# EAGLE board PiPanel (EAGLE 6.6.0)
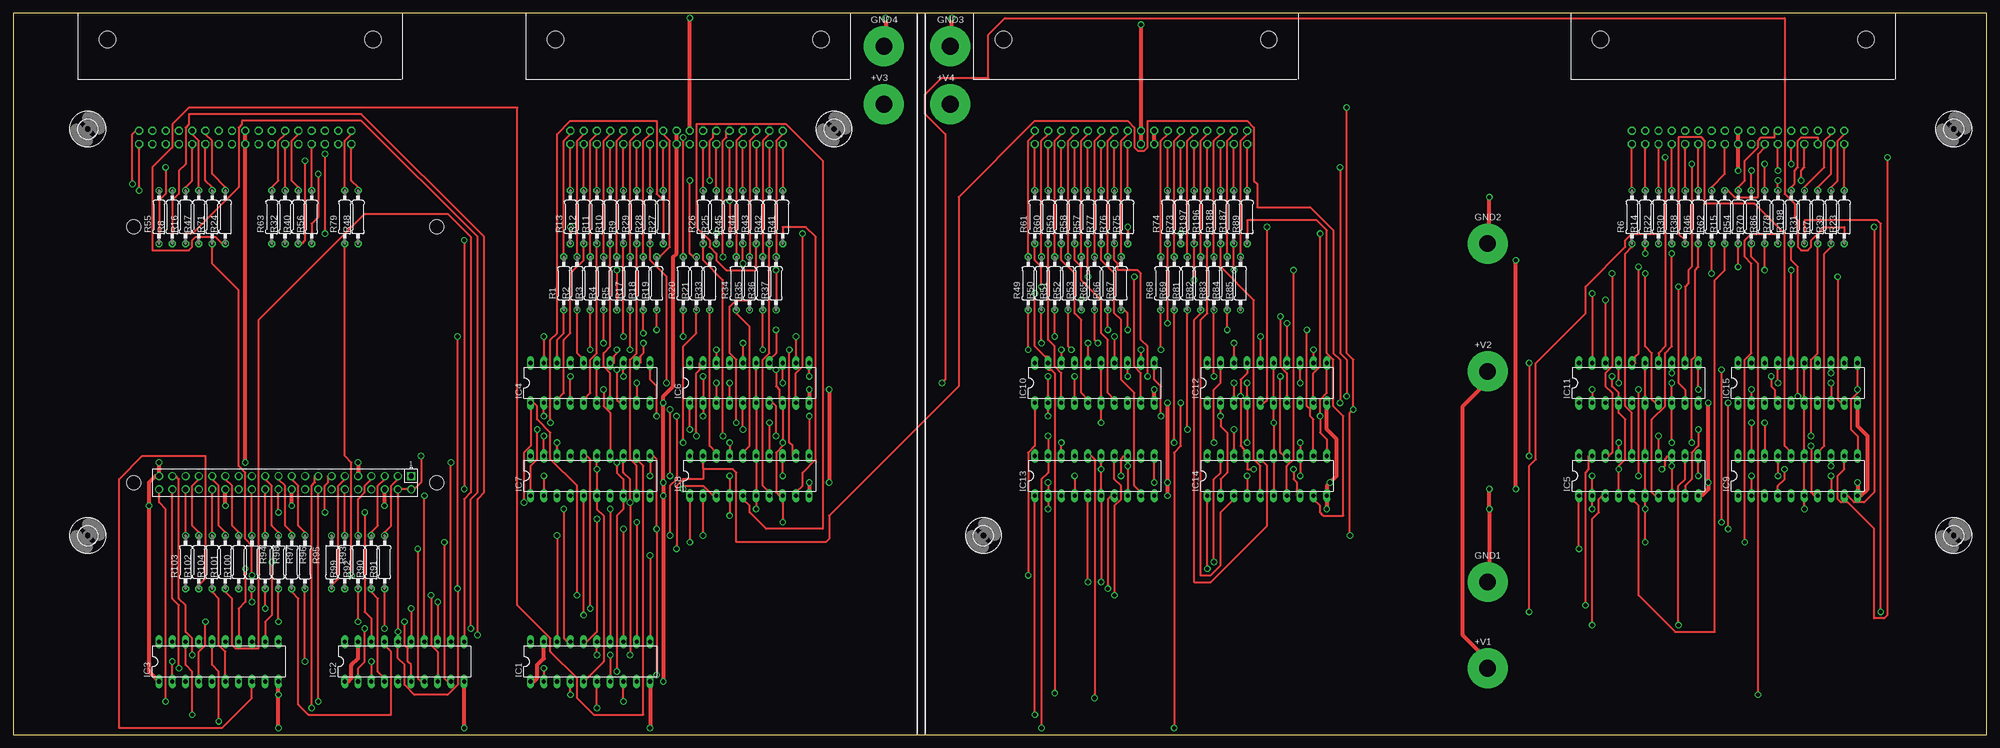
[diagram p2: board, top side]
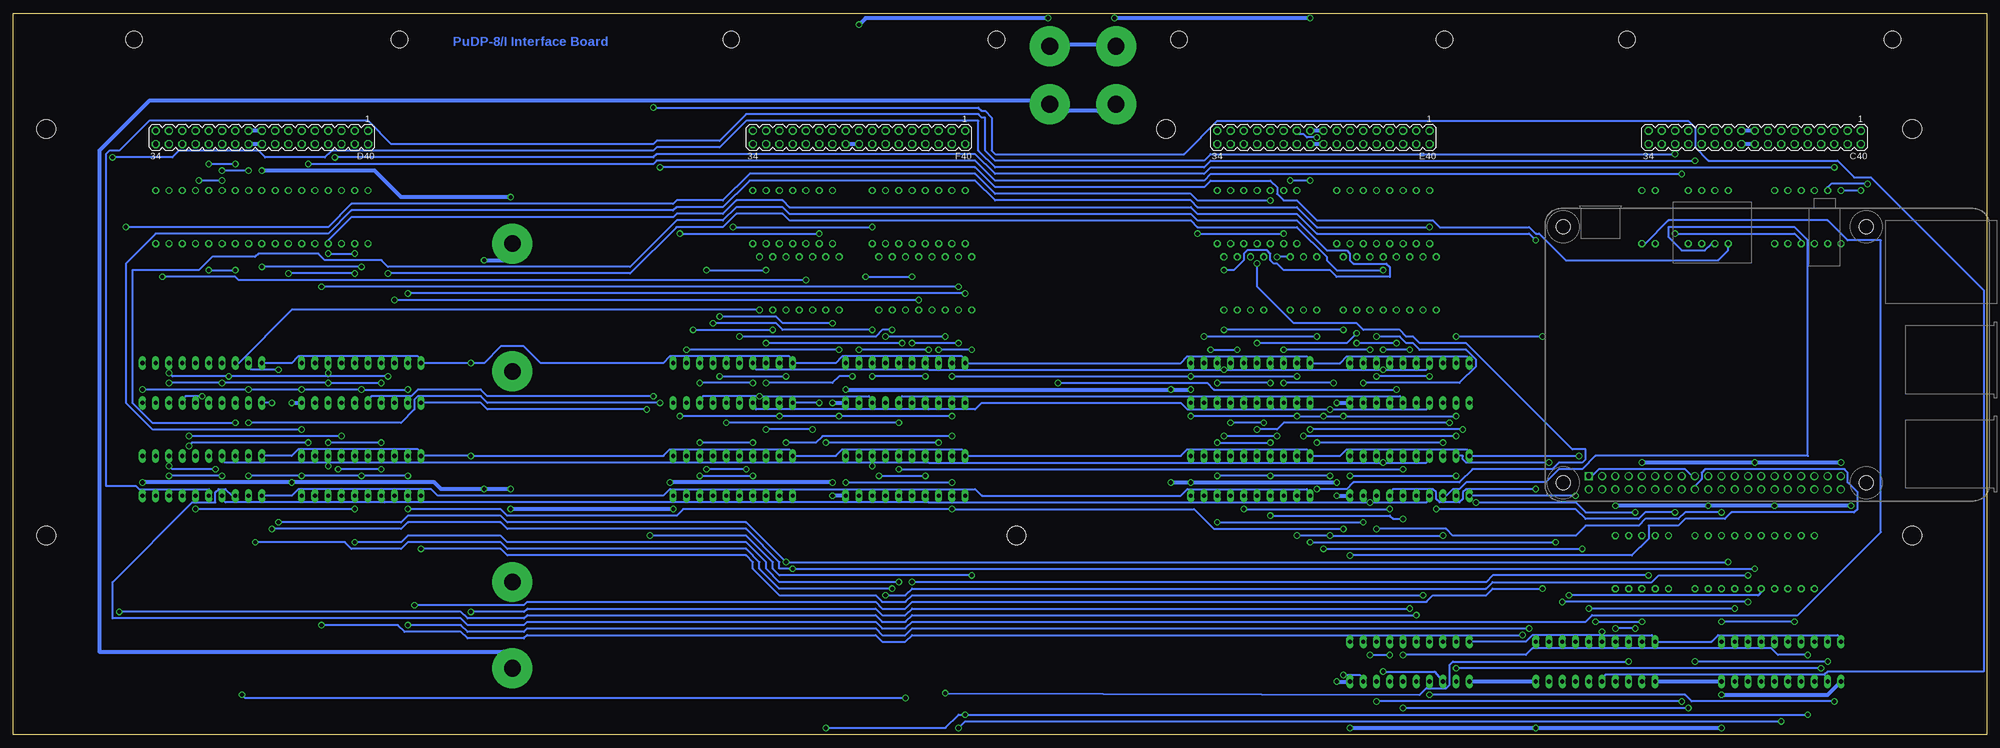
[diagram p3: board, bottom side, seen from below]

Size 377.82 x 138.11 mm. Coordinates in mm from the lower left corner, seen from the top.
Outline: 377.82,0 377.82,138.11 0,138.11 0,0 377.82,0
Outline: 174.62,0 377.82,0
Copper layers (1+16): Top 0.035mm / dielectric 1.5mm / Bottom 0.035mm
Design rules "16mils": minimum track width 16mil, minimum drill 32mil, track to track 15mil, track to pad 10mil, pad to pad 10mil, via to via 10mil, smd to smd 10mil, copper to edge 13mil, drill to drill 10mil, minimum pad ring 10mil, minimum via ring 8mil, stop-mask expansion 0mil, vias tented up to drill 0mil, thermal gap 10mil
Net classes: 1 supply: width 0.762 mm

## Footprints (pad centres in the part's own frame; a part is rotated, then mirrored left to right if it is on the bottom)
SPADELUG = drill 3.175 pad 7.62: 1 0,0
MA17-2 = drill 1.016 octagon: 1 -20.32,-1.27; 2 -20.32,1.27; 3 -17.78,-1.27; 4 -17.78,1.27; 5 -15.24,-1.27; 6 -15.24,1.27; 7 -12.7,-1.27; 8 -12.7,1.27; 9 -10.16,-1.27; 10 -10.16,1.27; 11 -7.62,-1.27; 12 -7.62,1.27; 13 -5.08,-1.27; 14 -5.08,1.27; 15 -2.54,-1.27; 16 -2.54,1.27; 17 0,-1.27; 18 0,1.27; 19 2.54,-1.27; 20 2.54,1.27; 21 5.08,-1.27; 22 5.08,1.27; 23 7.62,-1.27; 24 7.62,1.27; 25 10.16,-1.27; 26 10.16,1.27; 27 12.7,-1.27; 28 12.7,1.27; 29 15.24,-1.27; 30 15.24,1.27; 31 17.78,-1.27; 32 17.78,1.27; 33 20.32,-1.27; 34 20.32,1.27
DIL20 = drill 0.813 long: 1 -11.43,-3.81; 2 -8.89,-3.81; 3 -6.35,-3.81; 4 -3.81,-3.81; 5 -1.27,-3.81; 6 1.27,-3.81; 7 3.81,-3.81; 8 6.35,-3.81; 9 8.89,-3.81; 10 11.43,-3.81; 11 11.43,3.81; 12 8.89,3.81; 13 6.35,3.81; 14 3.81,3.81; 15 1.27,3.81; 16 -1.27,3.81; 17 -3.81,3.81; 18 -6.35,3.81; 19 -8.89,3.81; 20 -11.43,3.81
0207/10 = drill 0.813 octagon: 1 -5.08,0; 2 5.08,0
STRAIN-RELIEF = hole 3.175: 7.62,56.515; 7.62,5.715
3,6 = hole 3.6: 0,0
RASPI_BOARD_B+_FULL = drill 1.016 square: 1 8.878,52.119 | drill 1.016: 2 8.878,54.659; 3 11.418,52.119; 4 11.418,54.659; 5 13.958,52.119; 6 13.958,54.659; 7 16.498,52.119; 8 16.498,54.659; 9 19.038,52.119; 10 19.038,54.659; 11 21.578,52.119; 12 21.578,54.659; 13 24.118,52.119; 14 24.118,54.659; 15 26.658,52.119; 16 26.658,54.659; 17 29.198,52.119; 18 29.198,54.659; 19 31.738,52.119; 20 31.738,54.659; 21 34.278,52.119; 22 34.278,54.659; 23 36.818,52.119; 24 36.818,54.659; 25 39.358,52.119; 26 39.358,54.659; 27 41.898,52.119; 28 41.898,54.659; 29 44.438,52.119; 30 44.438,54.659; 31 46.978,52.119; 32 46.978,54.659; 33 49.518,52.119; 34 49.518,54.659; 35 52.058,52.119; 36 52.058,54.659; 37 54.598,52.119; 38 54.598,54.659; 39 57.138,52.119; 40 57.138,54.659 | hole 2.75: 4.008,4.389; 4.008,53.389; 62.008,4.389; 62.008,53.389

## Placement (x,y rotation side)
+V1  LUG  [SPADELUG]  282.26,12.7 0 top
+V2  LUG  [SPADELUG]  282.26,69.53 0 top
+V3  LUG  [SPADELUG]  166.69,120.65 0 top
+V4  LUG  [SPADELUG]  179.39,120.65 0 top
C40  [MA17-2]  44.45,114.3 180 bottom
D40  [MA17-2]  330.2,114.3 180 bottom
E40  [MA17-2]  127,114.3 180 bottom
F40  [MA17-2]  215.9,114.3 180 bottom
GND1  LUG  [SPADELUG]  282.26,29.21 0 top
GND2  LUG  [SPADELUG]  282.26,93.98 0 top
GND3  LUG  [SPADELUG]  179.39,131.76 0 top
GND4  LUG  [SPADELUG]  166.69,131.76 0 top
IC1  74LS244N  [DIL20]  110.49,13.97 0 top
IC2  74LS244N  [DIL20]  74.93,13.97 0 top
IC3  74LS244N  [DIL20]  39.37,13.97 0 top
IC4  74LS244N  [DIL20]  110.49,67.31 0 top
IC5  74LS244N  [DIL20]  311.15,49.53 0 top
IC6  74LS244N  [DIL20]  140.97,67.31 0 top
IC7  74LS244N  [DIL20]  110.49,49.53 0 top
IC8  74LS244N  [DIL20]  140.97,49.53 0 top
IC9  74LS244N  [DIL20]  341.63,49.53 0 top
IC10  74LS244N  [DIL20]  207.01,67.31 0 top
IC11  74LS244N  [DIL20]  311.15,67.31 0 top
IC12  74LS244N  [DIL20]  240.03,67.31 0 top
IC13  74LS244N  [DIL20]  207.01,49.53 0 top
IC14  74LS244N  [DIL20]  240.03,49.53 0 top
IC15  74LS244N  [DIL20]  341.63,67.31 0 top
R1  4.7K  [0207/10]  105.41,86.36 90 top
R2  4.7K  [0207/10]  107.95,86.36 90 top
R3  4.7K  [0207/10]  110.49,86.36 90 top
R4  4.7K  [0207/10]  113.03,86.36 90 top
R5  4.7K  [0207/10]  115.57,86.36 90 top
R6  4.7K  [0207/10]  309.88,99.06 90 top
R7  4.7K  [0207/10]  345.44,99.06 90 top
R8  4.7K  [0207/10]  30.48,99.06 90 top
R9  4.7K  [0207/10]  116.84,99.06 90 top
R10  4.7K  [0207/10]  114.3,99.06 90 top
R11  4.7K  [0207/10]  111.76,99.06 90 top
R12  4.7K  [0207/10]  109.22,99.06 90 top
R13  4.7K  [0207/10]  106.68,99.06 90 top
R14  4.7K  [0207/10]  312.42,99.06 90 top
R15  4.7K  [0207/10]  327.66,99.06 90 top
R16  4.7K  [0207/10]  33.02,99.06 90 top
R17  4.7K  [0207/10]  118.11,86.36 90 top
R18  4.7K  [0207/10]  120.65,86.36 90 top
R19  4.7K  [0207/10]  123.19,86.36 90 top
R20  4.7K  [0207/10]  128.27,86.36 90 top
R21  4.7K  [0207/10]  130.81,86.36 90 top
R22  4.7K  [0207/10]  314.96,99.06 90 top
R23  4.7K  [0207/10]  350.52,99.06 90 top
R24  4.7K  [0207/10]  40.64,99.06 90 top
R25  4.7K  [0207/10]  134.62,99.06 90 top
R26  4.7K  [0207/10]  132.08,99.06 90 top
R27  4.7K  [0207/10]  124.46,99.06 90 top
R28  4.7K  [0207/10]  121.92,99.06 90 top
R29  4.7K  [0207/10]  119.38,99.06 90 top
R30  4.7K  [0207/10]  317.5,99.06 90 top
R31  4.7K  [0207/10]  342.9,99.06 90 top
R32  4.7K  [0207/10]  52.07,99.06 90 top
R33  4.7K  [0207/10]  133.35,86.36 90 top
R34  4.7K  [0207/10]  138.43,86.36 90 top
R35  4.7K  [0207/10]  140.97,86.36 90 top
R36  4.7K  [0207/10]  143.51,86.36 90 top
R37  4.7K  [0207/10]  146.05,86.36 90 top
R38  4.7K  [0207/10]  320.04,99.06 90 top
R39  4.7K  [0207/10]  347.98,99.06 90 top
R40  4.7K  [0207/10]  54.61,99.06 90 top
R41  4.7K  [0207/10]  147.32,99.06 90 top
R42  4.7K  [0207/10]  144.78,99.06 90 top
R43  4.7K  [0207/10]  142.24,99.06 90 top
R44  4.7K  [0207/10]  139.7,99.06 90 top
R45  4.7K  [0207/10]  137.16,99.06 90 top
R46  4.7K  [0207/10]  322.58,99.06 90 top
R47  4.7K  [0207/10]  35.56,99.06 90 top
R48  4.7K  [0207/10]  66.04,99.06 90 top
R49  4.7K  [0207/10]  194.31,86.36 90 top
R50  4.7K  [0207/10]  196.85,86.36 90 top
R51  4.7K  [0207/10]  199.39,86.36 90 top
R52  4.7K  [0207/10]  201.93,86.36 90 top
R53  4.7K  [0207/10]  204.47,86.36 90 top
R54  4.7K  [0207/10]  330.2,99.06 90 top
R55  4.7K  [0207/10]  27.94,99.06 90 top
R56  4.7K  [0207/10]  57.15,99.06 90 top
R57  4.7K  [0207/10]  205.74,99.06 90 top
R58  4.7K  [0207/10]  203.2,99.06 90 top
R59  4.7K  [0207/10]  200.66,99.06 90 top
R60  4.7K  [0207/10]  198.12,99.06 90 top
R61  4.7K  [0207/10]  195.58,99.06 90 top
R62  4.7K  [0207/10]  325.12,99.06 90 top
R63  4.7K  [0207/10]  49.53,99.06 90 top
R65  4.7K  [0207/10]  207.01,86.36 90 top
R66  4.7K  [0207/10]  209.55,86.36 90 top
R67  4.7K  [0207/10]  212.09,86.36 90 top
R68  4.7K  [0207/10]  219.71,86.36 90 top
R69  4.7K  [0207/10]  222.25,86.36 90 top
R70  4.7K  [0207/10]  332.74,99.06 90 top
R71  4.7K  [0207/10]  38.1,99.06 90 top
R73  4.7K  [0207/10]  223.52,99.06 90 top
R74  4.7K  [0207/10]  220.98,99.06 90 top
R75  4.7K  [0207/10]  213.36,99.06 90 top
R76  4.7K  [0207/10]  210.82,99.06 90 top
R77  4.7K  [0207/10]  208.28,99.06 90 top
R78  4.7K  [0207/10]  337.82,99.06 90 top
R79  4.7K  [0207/10]  63.5,99.06 90 top
R81  4.7K  [0207/10]  224.79,86.36 90 top
R82  4.7K  [0207/10]  227.33,86.36 90 top
R83  4.7K  [0207/10]  229.87,86.36 90 top
R84  4.7K  [0207/10]  232.41,86.36 90 top
R85  4.7K  [0207/10]  234.95,86.36 90 top
R86  4.7K  [0207/10]  335.28,99.06 90 top
R89  4.7K  [0207/10]  236.22,99.06 90 top
R90  [0207/10]  68.58,33.02 90 top
R91  [0207/10]  71.12,33.02 90 top
R92  [0207/10]  66.04,33.02 90 top
R93  4K  [0207/10]  60.96,33.02 270 top
R94  [0207/10]  45.72,33.02 270 top
R95  [0207/10]  55.88,33.02 270 top
R96  [0207/10]  53.34,33.02 270 top
R97  [0207/10]  50.8,33.02 270 top
R98  [0207/10]  48.26,33.02 270 top
R99  4K  [0207/10]  63.5,33.02 90 top
R100  [0207/10]  43.18,33.02 90 top
R101  [0207/10]  40.64,33.02 90 top
R102  [0207/10]  35.56,33.02 90 top
R103  4K  [0207/10]  33.02,33.02 90 top
R104  [0207/10]  38.1,33.02 90 top
R187  4.7K  [0207/10]  233.68,99.06 90 top
R188  4.7K  [0207/10]  231.14,99.06 90 top
R196  4.7K  [0207/10]  228.6,99.06 90 top
R197  4.7K  [0207/10]  226.06,99.06 90 top
R198  4.7K  [0207/10]  340.36,99.06 90 top
U$1  [STRAIN-RELIEF]  74.61,125.41 90 top
U$2  [STRAIN-RELIEF]  160.34,125.41 90 top
U$3  [STRAIN-RELIEF]  246.06,125.41 90 top
U$4  [STRAIN-RELIEF]  360.36,125.41 90 top
U$5  [3,6]  371.48,115.89 0 top
U$6  [3,6]  371.48,38.1 0 top
U$7  [3,6]  185.74,38.1 0 top
U$8  [3,6]  14.29,38.1 0 top
U$9  [3,6]  14.29,115.89 0 top
U$11  [3,6]  157.16,115.89 0 top
X1  RASPI_BOARD_B+_F  [RASPI_BOARD_B+_FULL]  85.09,101.6 180 top

## Tracks (layer width: path | path; a pad name or v marks a point on that pad's centre or on a via)
+3V3
  Bottom 0.406: X1.17 56.52,49.53 57.78,50.8 74.3,50.8 75.56,49.53 X1.1
+15V
  Top 0.762: +V1.1 280.67,15.88 277.5,19.05 277.5,62.87 280.67,66.04 +V2.1
  Bottom 0.762: +V3.1 170.18,119.38 175.9,119.38 +V4.1 182.88,121.28 351.79,121.28 361.31,111.76 361.31,15.88 283.85,15.88 +V1.1
AC0
  Top 0.406: R4.2 113.03,113.67 114.3,114.94 E40.7
AC1
  Top 0.406: R12.2 E40.4
AC2  (via drill 0.81)
  Top 0.406: R20.2 v128.27,114.3
  Bottom 0.406: v128.27,114.3 130.18,114.3 130.81,114.94 132.08,114.94 E40.21
AC3
  Top 0.406: R28.2 E40.14
AC4
  Top 0.406: R36.2 143.51,113.67 144.78,114.94 E40.31
AC5
  Top 0.406: R44.2 E40.28
AC6
  Top 0.406: R52.2 201.93,113.67 203.2,114.94 F40.7
AC7
  Top 0.406: R60.2 F40.4
AC8
  Top 0.406: R68.2 219.71,113.67 220.98,114.94 F40.21
AC9
  Top 0.406: R76.2 F40.14
AC10
  Top 0.406: R84.2 232.41,113.67 233.68,114.94 F40.31
AC11
  Top 0.406: R196.2 F40.28
AND
  Top 0.406: R6.2 D40.2
BREAK
  Top 0.406: R15.2 328.3,104.14 329.56,102.87 334.01,102.87 334.01,111.12 335.28,112.39 D40.22
CA
  Top 0.406: R7.2 345.44,104.78 347.98,107.31 D40.32
COL1  (via drill 0.81)
  Top 0.406: v67.31,42.55 67.31,23.5 68.58,22.23 IC2.18 | v97.79,44.45 97.79,53.98 99.06,55.24 IC4.1 99.69,63.5 100.33,62.87 100.33,60.33 102.87,57.78 102.87,52.7 107.95,47.62 v107.95,26.67 | v299.72,35.56 IC5.1
  Bottom 0.406: v67.31,42.55 76.83,42.55 78.74,44.45 v97.79,44.45 | v299.72,35.56 284.48,35.56 283.21,34.29 237.49,34.29 236.22,33.02 236.22,31.75 231.14,26.67 212.72,26.67 211.46,25.4 207.01,25.4 205.74,26.67 v107.95,26.67
COL2  (via drill 0.81)
  Top 0.406: v85.09,76.2 v85.09,27.94 85.09,9.53 83.19,7.62 76.83,7.62 74.93,9.53 74.93,13.34 73.66,14.61 IC2.16 | v101.6,76.2 IC4.19 | v300.99,24.77 300.99,50.16 301.62,50.8 301.62,53.34 IC5.19
  Bottom 0.406: v85.09,76.2 v101.6,76.2 | v300.99,24.77 280.04,24.77 279.4,25.4 212.72,25.4 211.46,24.13 207.01,24.13 205.74,25.4 107.31,25.4 106.05,26.67 95.89,26.67 94.61,27.94 v85.09,27.94
COL3  (via drill 0.81)
  Top 0.406: IC2.14 v78.74,45.72 | v100.33,58.42 100.33,52.7 99.06,51.44 IC7.1 | v129.54,58.42 IC6.1
  Bottom 0.406: v78.74,45.72 IC7.1 | v100.33,58.42 v129.54,58.42
COL4  (via drill 0.81)
  Top 0.406: IC2.12 v83.82,52.07 | v130.81,57.15 130.81,69.22 131.44,69.85 131.44,71.12 IC6.19 | IC7.19 v101.6,57.15
  Bottom 0.406: v83.82,52.07 99.69,52.07 100.33,52.7 100.33,53.34 IC7.19 | v101.6,57.15 v130.81,57.15
COL5  (via drill 0.81)
  Top 0.406: v82.55,36.83 82.55,10.79 83.19,10.16 IC2.9 | IC8.1 v129.54,36.83
  Bottom 0.406: IC9.1 324.49,45.72 323.21,46.99 297.81,46.99 296.55,45.72 253.37,45.72 252.09,46.99 193.68,46.99 192.41,45.72 154.31,45.72 153.03,46.99 130.18,46.99 129.54,46.35 IC8.1 | v129.54,36.83 v82.55,36.83
COL6  (via drill 0.81)
  Top 0.406: v77.47,35.56 77.47,10.79 78.11,10.16 IC2.7 | v127,35.56 127,47.62 128.27,48.9 132.08,48.9 132.08,50.8 | 132.08,50.8 IC8.19 | v254,63.5 254,71.75 252.73,73.03 252.73,96.52 248.28,100.97 238.12,100.97 238.12,105.41 237.49,106.05 237.49,116.2 236.22,117.47 217.17,117.47 217.17,112.39 216.53,111.76 215.26,111.76 214.63,112.39 214.63,116.2 213.36,117.47 195.58,117.47 180.97,102.87 180.97,66.67 156.21,41.91 156.21,37.47 155.57,36.83 138.43,36.83 138.43,50.16 137.79,50.8 132.08,50.8 | v332.74,59.69 IC9.19
  Bottom 0.406: v127,35.56 v77.47,35.56 | v332.74,59.69 303.53,59.69 300.99,62.23 300.99,64.14 300.36,64.77 288.29,64.77 287.02,63.5 v254,63.5
COL7  (via drill 0.81)
  Top 0.406: v255.27,120.02 255.27,73.03 256.54,71.75 v256.54,62.23 255.91,61.59 v255.91,38.1 | v194.31,30.48 194.31,53.98 195.58,55.24 IC10.1
  Bottom 0.406: v256.54,62.23 287.02,62.23 288.29,63.5 IC11.1 | v255.27,120.02 193.04,120.02 192.41,119.38 191.77,119.38 190.5,118.11 190.5,111.76 189.87,111.12 153.67,111.12 147.32,117.47 57.15,117.47 55.88,116.2 55.88,112.39 53.34,109.86 28.57,109.86 25.4,106.68 22.23,106.68 0.64,85.09 0.64,12.06 30.48,12.06 31.11,11.43 73.03,11.43 73.66,10.79 IC2.5 | v194.31,30.48 231.14,30.48 232.41,31.75 232.41,33.02 237.49,38.1 v255.91,38.1
COL8  (via drill 0.81)
  Top 0.406: v199.39,7.94 199.39,69.22 198.75,69.85 198.12,69.85 IC10.19 198.12,72.39 197.49,72.39 195.58,74.3 v195.58,84.45 | v68.58,13.97 IC2.3 | v302.26,84.45 IC11.19
  Bottom 0.406: v68.58,13.97 102.23,13.97 102.87,13.34 102.87,9.53 103.5,8.89 107.31,8.89 108.58,7.62 v199.39,7.94 | v195.58,84.45 v302.26,84.45
COL9  (via drill 0.81)
  Top 0.406: v34.29,3.81 34.29,12.06 33.02,13.34 IC3.18 | v195.58,3.81 IC13.1 | v223.52,63.5 223.52,55.24 222.25,53.98 v222.25,1.27
  Bottom 0.406: v34.29,3.81 v195.58,3.81 196.85,3.81 199.39,1.27 v222.25,1.27 | v223.52,63.5 IC12.1
COL10  (via drill 0.81)
  Top 0.406: v39.37,2.54 39.37,12.06 38.1,13.34 IC3.16 | v196.85,1.27 196.85,48.9 198.12,50.16 IC13.19 v198.12,57.15 | v229.87,55.88 229.87,66.04 231.14,67.31 IC12.19
  Bottom 0.406: v39.37,2.54 195.58,2.54 v196.85,1.27 | v229.87,55.88 224.16,55.88 222.88,57.15 v198.12,57.15
COL11  (via drill 0.81)
  Top 0.406: v44.45,31.75 44.45,25.4 43.18,24.13 IC3.14 | v228.6,31.75 IC14.1 | v328.3,39.37 v328.3,63.5
  Bottom 0.406: v44.45,31.75 v228.6,31.75 231.14,31.75 231.14,33.02 237.49,39.37 283.21,39.37 284.48,40.64 302.26,40.64 303.53,39.37 v328.3,39.37 | v328.3,63.5 IC15.1
COL12  (via drill 0.81)
  Top 0.406: v49.53,33.02 49.53,22.86 48.26,21.59 IC3.12 | v229.87,33.02 229.87,48.9 231.14,50.16 IC14.19 | v327.02,40.64 v327.02,69.85
  Bottom 0.406: v49.53,33.02 v229.87,33.02 237.49,40.64 283.21,40.64 284.48,41.91 302.26,41.91 303.53,40.64 v327.02,40.64 | v327.02,69.85 332.11,69.85 332.74,70.48 IC15.19
DCA
  Top 0.406: R30.2 D40.8
DEFER  (via drill 0.81)
  Top 0.406: R86.2 v335.28,109.22 | v340.36,109.22 D40.26
  Bottom 0.406: v335.28,109.22 v340.36,109.22
DF0  (via drill 0.81)
  Top 0.406: v22.86,105.41 22.86,114.94 23.5,115.57 C40.1
  Bottom 0.406: v22.86,105.41 29.84,105.41 30.48,104.78 R8.2
DF1
  Top 0.406: R16.2 33.02,104.78 34.29,106.05 C40.10
DF2
  Top 0.406: R24.2 40.64,104.78 38.1,107.31 38.1,113.67 36.83,114.94 C40.11
EXECUTE  (via drill 0.81)
  Top 0.406: v342.26,106.05 342.26,107.95 342.9,108.58 D40.28 | R78.2 v337.82,106.05
  Bottom 0.406: v337.82,106.05 v342.26,106.05
FETCH  (via drill 0.81)
  Top 0.406: R70.2 v332.74,107.95 | v337.82,107.95 D40.24
  Bottom 0.406: v332.74,107.95 v337.82,107.95
GND  (via drill 0.81)
  Top 0.762: D40.17 D40.18 v330.2,107.95 | v282.57,102.87 282.57,97.16 GND2.1 | IC10.10 v218.44,66.04 | v152.4,66.04 IC6.10 | v220.98,63.5 v220.98,48.26 v220.98,45.72 | IC15.10 353.06,59.05 354.96,57.15 354.96,46.99 353.69,45.72 IC9.10 v353.06,48.26 | v324.49,63.5 v324.49,48.26 324.49,46.99 323.21,45.72 IC5.10 | v251.46,43.18 IC14.10 251.46,47.62 v252.09,48.26 253.37,49.53 253.37,56.52 251.46,58.42 IC12.10 | GND1.1 282.57,32.38 v282.57,43.18 v282.57,46.99 | v287.65,46.99 v287.65,90.81 | C40.17 C40.18 v44.45,52.07 | v40.64,43.81 40.64,46.35 X1.30 | v53.34,43.81 53.34,46.35 X1.20 | v66.04,52.07 66.04,50.16 X1.9 | v27.94,52.07 27.94,50.16 X1.39 27.3,49.53 26.04,48.26 v26.04,43.81 26.04,12.06 IC3.1 | v71.12,43.81 71.12,46.35 X1.6 | IC3.10 v50.8,7.62 v50.8,1.27 | IC2.19 66.04,14.61 64.77,13.34 64.77,10.79 64.14,10.16 IC2.1 | IC1.19 101.6,14.61 100.33,13.34 100.33,10.79 99.69,10.16 IC1.1 | IC1.10 v121.92,1.27 | v86.36,1.27 IC2.10 | F40.18 F40.17 v215.9,135.89 | F40.20 F40.19 | v179.71,137.16 179.71,135.25 GND3.1 | E40.17 E40.18 127,92.08 126.36,91.44 126.36,66.67 124.46,64.77 v124.46,63.5 v124.46,48.26 v124.46,45.72 v124.46,10.16 | v152.4,48.26 IC8.10 | v167,137.16 167,135.25 GND4.1 | E40.19 v129.54,137.16 | v156.21,66.04 v156.21,48.26
  Bottom 0.762: D40.18 D40.20 | D40.17 D40.19 | v330.2,107.95 308.61,107.95 303.53,102.87 v282.57,102.87 | v152.4,66.04 v156.21,66.04 v218.44,66.04 | IC13.10 v220.98,45.72 | v220.98,63.5 IC10.10 | v324.49,63.5 IC11.10 | v353.06,48.26 v324.49,48.26 297.18,48.26 295.91,46.99 v287.65,46.99 v282.57,46.99 | v251.46,43.18 v282.57,43.18 | v220.98,48.26 v252.09,48.26 | v287.65,90.81 283.85,90.81 GND2.1 | C40.18 C40.20 | C40.17 C40.19 | v26.04,43.81 v40.64,43.81 v53.34,43.81 v71.12,43.81 | v27.94,52.07 v44.45,52.07 v66.04,52.07 | v50.8,7.62 30.48,7.62 IC3.1 | IC3.10 IC2.1 | IC2.10 IC1.1 | v121.92,1.27 v86.36,1.27 v50.8,1.27 | F40.18 F40.20 | v215.9,135.89 214.63,137.16 v179.71,137.16 | GND4.1 170.18,132.08 175.9,132.08 GND3.1 | E40.18 E40.20 | E40.17 E40.19 | v124.46,45.72 IC7.10 | v124.46,63.5 IC4.10 | v124.46,48.26 v152.4,48.26 v156.21,48.26 | v129.54,137.16 v167,137.16 | v124.46,10.16 IC1.10
IF0
  Top 0.406: R32.2 C40.24
IF1
  Top 0.406: R40.2 54.61,104.78 53.34,106.05 53.34,113.67 54.61,114.94 C40.25
IF2
  Top 0.406: R48.2 66.04,104.78 64.77,106.05 C40.34
ION
  Top 0.406: R23.2 D40.34
IOT
  Top 0.406: R54.2 330.2,104.78 331.47,106.05 331.47,109.86 334.01,112.39 334.01,113.67 334.64,114.3 337.19,114.3 337.19,115.57 D40.23
ISZ
  Top 0.406: R22.2 D40.6
JMP
  Top 0.406: R46.2 D40.12
JMS
  Top 0.406: R38.2 D40.10
LED1  (via drill 0.81)
  Top 0.406: IC14.11 251.46,56.52 250.19,57.78 v250.19,60.96 250.19,64.14 251.46,65.41 IC12.11 | v198.12,60.96 IC10.2 v198.12,68.58 | IC12.2 v231.14,60.96 231.14,59.05 232.41,57.78 232.41,50.16 231.14,48.9 IC14.2 | v219.71,60.96 219.71,66.67 218.44,67.94 IC10.11 | v104.14,38.1 IC1.18 | v132.08,38.1 IC8.2 | v101.6,60.96 IC4.2 | v132.08,60.96 IC6.2 v132.08,68.58 | v152.4,60.96 IC8.11 | v123.19,60.96 123.19,66.67 121.92,67.94 IC4.11 | v152.4,68.58 IC6.11 | v125.73,38.1 125.73,47.62 127,48.9 v127,60.96
  Bottom 0.406: v198.12,60.96 v219.71,60.96 v231.14,60.96 v250.19,60.96 | v132.08,38.1 v125.73,38.1 v104.14,38.1 | v101.6,60.96 v123.19,60.96 v127,60.96 v132.08,60.96 v152.4,60.96 | v132.08,68.58 v152.4,68.58 v198.12,68.58
LED2  (via drill 0.81)
  Top 0.406: v111.76,41.27 111.76,19.68 109.86,17.78 IC1.16 | v137.16,41.91 IC8.4 v137.16,49.53 | v147.32,49.53 IC8.13 | v236.22,49.53 IC14.4 | v246.38,49.53 IC14.13 v246.38,55.88 | v116.84,68.58 IC4.13 | IC4.4 v106.68,68.58 | v147.32,67.31 IC6.13 | IC6.4 v137.16,67.31 | v213.36,68.58 IC10.13 | IC10.4 v203.2,68.58 | v246.38,67.31 IC12.13 | v236.22,67.31 IC12.4 v236.22,55.88 | v125.73,62.23 v125.73,49.53
  Bottom 0.406: v111.76,41.27 113.67,41.27 114.3,41.91 v137.16,41.91 | v147.32,49.53 v137.16,49.53 v125.73,49.53 | v246.38,49.53 v236.22,49.53 | 136.53,62.23 137.16,62.87 IC6.4 | 136.53,62.23 v125.73,62.23 107.31,62.23 106.68,62.87 IC4.4 | 202.56,62.23 203.2,62.87 IC10.4 | 202.56,62.23 193.68,62.23 192.41,63.5 154.31,63.5 153.03,62.23 136.53,62.23 | 202.56,62.23 235.59,62.23 236.22,62.87 IC12.4 | v106.68,68.58 v116.84,68.58 | v137.16,67.31 v147.32,67.31 | v203.2,68.58 v213.36,68.58 | v236.22,67.31 v246.38,67.31 | v236.22,55.88 v246.38,55.88
LED3  (via drill 0.81)
  Top 0.406: IC6.15 IC6.6 IC8.15 IC8.6 v142.24,43.18 | v114.3,43.18 IC1.14 | IC14.6 IC14.15 v241.3,59.69 IC12.6 IC12.15 | IC4.6 IC4.15 | IC10.15 IC10.6 v208.28,59.69
  Bottom 0.406: v142.24,43.18 v114.3,43.18 | 142.24,64.77 112.39,64.77 111.76,64.14 IC4.6 | 142.24,64.77 207.65,64.77 208.28,64.14 IC10.6 | v208.28,59.69 v241.3,59.69 | 142.24,64.77 IC6.6
LED4  (via drill 0.81)
  Top 0.406: v119.38,40.64 IC1.12 | v147.32,40.64 IC8.8 146.69,45.72 146.05,46.35 146.05,53.98 147.32,55.24 v147.32,55.88 IC6.8 146.69,63.5 146.69,66.04 146.05,66.67 v146.05,69.85 | v245.11,50.8 245.11,48.9 245.75,48.26 245.75,45.72 IC14.8 | v237.49,50.8 236.22,50.8 IC14.17 235.59,53.34 235.59,54.61 234.95,55.24 v234.95,64.77 234.95,67.94 236.22,69.22 IC12.17 | v137.16,55.88 IC8.17 | v115.57,69.85 115.57,64.14 116.2,63.5 IC4.8
  Bottom 0.406: v147.32,40.64 v119.38,40.64 | IC12.8 246.38,64.14 245.75,64.77 v234.95,64.77 214,64.77 213.36,64.14 IC10.8 | v237.49,50.8 v245.11,50.8 | v147.32,55.88 v137.16,55.88 | 136.53,69.85 137.16,70.48 IC6.17 | 136.53,69.85 v115.57,69.85 107.31,69.85 106.68,70.48 IC4.17 | 202.56,69.85 203.2,70.48 IC10.17 | 136.53,69.85 v146.05,69.85 202.56,69.85 | 202.56,69.85 235.59,69.85 236.22,70.48 IC12.17
LED5  (via drill 0.81)
  Top 0.406: v302.26,49.53 IC5.2 v302.26,43.18 | v322.58,49.53 IC5.11 | v332.74,49.53 IC9.2 | IC9.11 353.06,57.15 351.79,58.42 351.79,64.14 353.06,65.41 v353.06,66.04 IC15.11 | v302.26,66.04 IC11.2 | v322.58,66.04 IC11.11 | v332.74,66.04 IC15.2 | v311.15,49.53 v311.15,66.04 | v198.12,48.26 IC13.2 v198.12,43.18 | v218.44,48.26 IC13.11 | v123.19,11.43 v123.19,39.37 123.19,52.7 122.56,53.34 IC7.11 v121.92,49.53 | v101.6,49.53 IC7.2
  Bottom 0.406: v302.26,49.53 v311.15,49.53 v322.58,49.53 v332.74,49.53 | v302.26,66.04 v311.15,66.04 v322.58,66.04 v332.74,66.04 v353.06,66.04 | v218.44,48.26 v198.12,48.26 | v123.19,11.43 120.02,11.43 119.38,10.79 IC1.9 | v121.92,49.53 v101.6,49.53 | v123.19,39.37 147.96,39.37 151.76,43.18 v198.12,43.18 249.56,43.18 250.82,41.91 283.21,41.91 284.48,43.18 v302.26,43.18
LED6  (via drill 0.81)
  Top 0.406: v118.11,15.24 v118.11,44.45 118.11,48.9 116.84,50.16 IC7.13 | v114.3,15.24 IC1.7 | v212.09,49.53 212.09,52.7 212.72,53.34 IC13.13 | v203.2,49.53 IC13.4 | IC5.4 v307.34,50.8 307.34,51.44 308.61,52.7 308.61,60.33 307.34,61.59 IC11.4 307.34,65.41 306.07,66.67 v306.07,68.58 | v315.6,50.8 316.23,51.44 316.23,52.7 316.87,53.34 IC5.13 | v317.5,69.22 IC11.13 | v336.55,68.58 336.55,66.67 337.19,66.04 337.19,63.5 IC15.4 | v339.09,50.8 339.09,48.9 337.82,47.62 IC9.4 | v347.98,51.44 IC9.13 | v347.98,69.22 IC15.13
  Bottom 0.406: v118.11,15.24 v114.3,15.24 | 202.56,44.45 203.2,45.09 IC13.4 | 202.56,44.45 v118.11,44.45 107.31,44.45 106.68,45.09 IC7.4 | 306.7,44.45 307.34,45.09 IC5.4 | 202.56,44.45 306.7,44.45 | 306.7,44.45 337.19,44.45 337.82,45.09 IC9.4 | v212.09,49.53 v203.2,49.53 | v307.34,50.8 v315.6,50.8 | 317.5,68.58 v317.5,69.22 | v306.07,68.58 317.5,68.58 | 317.5,68.58 v336.55,68.58 347.35,68.58 v347.98,69.22 | v347.98,51.44 347.35,50.8 v339.09,50.8
LED7  (via drill 0.81)
  Top 0.406: IC11.15 IC11.6 IC5.15 IC5.6 v312.42,43.18 v312.42,36.83 | IC15.15 IC15.6 IC9.15 IC9.6 v342.9,43.18 | IC13.15 v208.28,50.8 IC13.6 v208.28,29.21 | IC1.5 113.03,13.97 113.03,41.91 111.76,43.18 IC7.6 v111.76,50.8 IC7.15
  Bottom 0.406: v312.42,43.18 v342.9,43.18 | v208.28,50.8 v111.76,50.8 | v312.42,36.83 303.53,36.83 302.26,38.1 284.48,38.1 283.21,36.83 237.49,36.83 233.68,33.02 233.68,31.75 231.14,29.21 v208.28,29.21
LED8  (via drill 0.81)
  Top 0.406: v115.57,12.06 115.57,41.91 116.84,43.18 IC7.8 116.84,48.9 115.57,50.16 v115.57,52.07 | v337.82,67.31 IC15.17 | v347.98,67.31 IC15.8 | v307.34,67.31 IC11.17 | v317.5,67.31 IC11.8 v317.5,55.88 | v213.36,51.44 IC13.8 | v317.5,51.44 IC5.8 | v347.98,49.53 IC9.8 | IC9.17 v337.82,49.53 | IC5.17 v307.34,55.88
  Bottom 0.406: v115.57,12.06 105.73,12.06 IC1.3 | v347.98,67.31 v337.82,67.31 v317.5,67.31 v307.34,67.31 | 202.56,52.07 203.2,52.7 IC13.17 | 202.56,52.07 v115.57,52.07 107.31,52.07 106.68,52.7 IC7.17 | 306.7,52.07 307.34,52.7 IC5.17 | 202.56,52.07 213.36,52.07 | 213.36,52.07 306.7,52.07 | 306.7,52.07 317.5,52.07 | 317.5,52.07 337.19,52.07 337.82,52.7 IC9.17 | 213.36,52.07 v213.36,51.44 | 317.5,52.07 v317.5,51.44 | v337.82,49.53 v347.98,49.53 | v307.34,55.88 v317.5,55.88
LINK
  Top 0.406: R56.2 C40.28
MA0
  Top 0.406: R2.2 107.95,113.67 109.22,114.94 E40.3
MA1
  Top 0.406: R10.2 E40.8
MA2
  Top 0.406: R18.2 120.65,113.67 121.92,114.94 E40.13
MA3
  Top 0.406: R26.2 E40.22
MA4
  Top 0.406: R34.2 138.43,113.67 139.7,114.94 E40.27
MA5
  Top 0.406: E40.32 R42.2
MA6
  Top 0.406: R50.2 196.85,113.67 198.12,114.94 F40.3
MA7
  Top 0.406: R58.2 F40.8
MA8
  Top 0.406: R66.2 209.55,113.67 210.82,114.94 F40.13
MA9
  Top 0.406: R74.2 F40.22
MA10
  Top 0.406: R82.2 227.33,113.67 228.6,114.94 F40.27
MA11
  Top 0.406: R187.2 F40.32
MB0
  Top 0.406: R3.2 110.49,113.67 111.76,114.94 E40.5
MB1
  Top 0.406: R11.2 E40.6
MB2
  Top 0.406: R19.2 123.83,91.44 125.73,93.34 125.73,113.67 124.46,114.94 E40.15
MB3
  Top 0.406: R27.2 E40.16
MB4
  Top 0.406: R35.2 140.97,113.67 142.24,114.94 E40.29
MB5
  Top 0.406: E40.30 R43.2
MB6
  Top 0.406: R51.2 199.39,113.67 200.66,114.94 F40.5
MB7
  Top 0.406: R59.2 F40.6
MB8
  Top 0.406: R67.2 212.09,113.67 213.36,114.94 F40.15
MB9
  Top 0.406: R75.2 F40.16
MB10
  Top 0.406: R83.2 229.87,113.67 231.14,114.94 F40.29
MB11
  Top 0.406: R188.2 F40.30
MQ0
  Top 0.406: R5.2 115.57,113.67 116.84,114.94 E40.9
MQ1
  Top 0.406: R13.2 E40.2
MQ2  (via drill 0.81)
  Top 0.406: v129.54,106.05 129.54,92.08 130.18,91.44 R21.2 | v133.35,106.05 133.35,113.67 133.99,114.3 133.99,115.57 E40.23
  Bottom 0.406: v129.54,106.05 v133.35,106.05
MQ3
  Top 0.406: R29.2 E40.12
MQ4
  Top 0.406: R37.2 146.05,113.67 147.32,114.94 E40.33
MQ5
  Top 0.406: R45.2 E40.26
MQ6
  Top 0.406: R53.2 204.47,113.67 205.74,114.94 F40.9
MQ7
  Top 0.406: R61.2 F40.2
MQ8
  Top 0.406: R69.2 222.25,113.67 223.52,114.94 F40.23
MQ9
  Top 0.406: R77.2 F40.12
MQ10
  Top 0.406: R85.2 234.95,113.67 236.22,114.94 F40.33
MQ11
  Top 0.406: R197.2 F40.26
N$1
  Top 0.406: IC4.18 104.14,75.56 105.41,76.83 R1.1
N$2  (via drill 0.81)
  Top 0.406: v120.65,74.93 120.65,73.03 120.02,72.39 120.02,71.12 IC4.12 | v113.03,74.93 R4.1
  Bottom 0.406: v113.03,74.93 v120.65,74.93
N$3  (via drill 0.81)
  Top 0.406: v115.57,73.66 115.57,73.03 114.94,72.39 114.94,71.12 IC4.14 | v110.49,73.66 R3.1
  Bottom 0.406: v110.49,73.66 v115.57,73.66
N$4
  Top 0.406: IC4.16 109.22,71.75 107.95,73.03 R2.1
N$5  (via drill 0.81)
  Top 0.406: v306.07,88.27 306.07,70.48 304.8,69.22 304.8,66.67 306.07,65.41 306.07,53.98 305.44,53.34 IC5.18 | v115.57,88.9 R5.1
  Bottom 0.406: v306.07,88.27 259.71,88.27 250.82,97.16 241.94,97.16 239.4,99.69 230.5,99.69 229.24,98.42 152.4,98.42 151.13,97.16 132.08,97.16 126.36,91.44 126.36,90.81 124.46,88.9 v115.57,88.9
N$6
  Top 0.406: IC5.16 309.88,61.59 308.61,62.87 308.61,92.08 309.88,93.34 R6.1
N$7  (via drill 0.81)
  Top 0.406: v344.17,57.15 344.17,71.75 345.44,73.03 R7.1 | IC5.14 v314.96,57.15
  Bottom 0.406: v314.96,57.15 v344.17,57.15
N$8  (via drill 0.81)
  Top 0.406: v318.77,20.95 318.77,47.62 320.04,48.9 IC5.12 | v88.9,19.05 88.9,45.09 90.17,46.35 90.17,95.25 66.67,118.75 33.66,118.75 33.66,116.84 33.02,116.2 33.02,109.22 31.75,107.95 31.75,103.5 30.48,102.23 R8.1
  Bottom 0.406: v318.77,20.95 304.17,20.95 302.89,19.68 292.1,19.68 290.83,18.41 280.04,18.41 279.4,19.05 212.72,19.05 211.46,17.78 207.01,17.78 205.74,19.05 v88.9,19.05
N$9  (via drill 0.81)
  Top 0.406: v119.38,67.31 IC4.9 | v116.84,76.2 R9.1
  Bottom 0.406: v119.38,67.31 100.97,67.31 97.79,70.48 97.79,71.75 99.69,73.66 108.58,73.66 109.86,74.93 111.12,74.93 112.39,76.2 v116.84,76.2
N$10
  Top 0.406: IC4.3 104.14,64.14 105.41,65.41 105.41,75.56 106.68,76.83 106.68,88.27 109.22,90.81 R12.1
N$11
  Top 0.406: IC4.5 109.22,64.14 110.49,65.41 110.49,71.75 111.76,73.03 R11.1
N$12
  Top 0.406: IC4.7 114.3,69.22 113.03,70.48 113.03,73.03 114.3,74.3 R10.1
N$13  (via drill 0.81)
  Top 0.406: v322.58,58.42 322.58,55.24 321.31,53.98 321.31,48.9 320.04,47.62 IC5.9 | v106.68,97.16 R13.1
  Bottom 0.406: v106.68,97.16 128.27,97.16 132.08,100.97 151.13,100.97 152.4,102.23 189.87,102.23 193.68,106.05 236.85,106.05 241.94,100.97 250.82,100.97 251.46,100.33 313.06,100.33 317.5,95.89 350.52,95.89 356.24,90.17 356.24,63.5 351.15,58.42 v322.58,58.42
N$14  (via drill 0.81)
  Top 0.406: v317.5,92.08 317.5,74.3 316.23,73.03 316.23,62.87 313.69,60.33 313.69,46.35 314.32,45.72 IC5.7 | v312.42,92.08 R14.1
  Bottom 0.406: v317.5,92.08 v312.42,92.08
N$15
  Top 0.406: IC5.5 309.88,45.09 311.15,43.81 311.15,26.67 318.13,19.68 325.75,19.68 325.75,87 327.66,88.9 R15.1
N$16  (via drill 0.81)
  Top 0.406: v302.26,20.95 302.26,41.27 303.53,42.55 303.53,45.09 304.17,45.72 IC5.3 | v87.63,20.32 87.63,45.09 88.9,46.35 88.9,95.25 66.67,117.47 43.81,117.47 43.81,116.84 43.18,116.2 43.18,104.78 34.29,95.89 33.02,95.89 R16.1
  Bottom 0.406: v302.26,20.95 292.1,20.95 290.83,19.68 280.04,19.68 279.4,20.32 212.72,20.32 211.46,19.05 207.01,19.05 205.74,20.32 v87.63,20.32
N$17  (via drill 0.81)
  Top 0.406: v118.11,73.66 R17.1 | v134.62,73.66 IC6.18
  Bottom 0.406: v118.11,73.66 v134.62,73.66
N$18  (via drill 0.81)
  Top 0.406: v128.27,76.2 R20.1 | v149.86,76.2 IC6.12
  Bottom 0.406: v128.27,76.2 v149.86,76.2
N$19  (via drill 0.81)
  Top 0.406: v146.05,77.47 146.05,73.03 144.78,71.75 IC6.14 | v123.19,77.47 R19.1
  Bottom 0.406: v123.19,77.47 v146.05,77.47
N$20  (via drill 0.81)
  Top 0.406: v120.65,76.83 R18.1 | v139.7,74.93 IC6.16
  Bottom 0.406: v120.65,76.83 122.56,74.93 v139.7,74.93
N$21  (via drill 0.81)
  Top 0.406: v128.27,55.88 128.27,74.3 130.81,76.83 R21.1 | IC7.18 v104.14,55.88
  Bottom 0.406: v104.14,55.88 v128.27,55.88
N$22  (via drill 0.81)
  Top 0.406: v110.49,24.13 110.49,52.7 109.86,53.34 IC7.16 | v290.19,23.5 290.19,51.44 291.46,52.7 291.46,71.12 300.99,80.64 300.99,85.72 308.61,93.34 308.61,94.61 309.88,95.89 314.96,95.89 R22.1
  Bottom 0.406: v110.49,24.13 205.74,24.13 207.01,22.86 211.46,22.86 212.72,24.13 279.4,24.13 280.04,23.5 v290.19,23.5
N$23  (via drill 0.81)
  Top 0.406: v113.03,66.04 113.03,62.87 114.3,61.59 IC7.14 | v177.8,67.31 178.44,67.94 178.44,114.94 174.62,118.75 174.62,122.56 177.8,125.73 186.69,125.73 186.69,133.99 189.87,137.16 339.09,137.16 339.09,103.5 341,101.6 341,99.06 341.63,98.42 341.63,93.34 342.26,92.71 343.54,92.71 344.17,93.34 344.17,94.61 346.71,97.16 350.52,97.16 R23.1
  Bottom 0.406: v113.03,66.04 147.96,66.04 149.22,67.31 v177.8,67.31
N$24
  Top 0.406: R24.1 40.01,93.98 38.73,95.25 34.92,95.25 34.29,94.61 34.29,93.34 33.66,92.71 26.67,92.71 26.67,108.58 30.48,112.39 30.48,116.84 33.66,120.02 96.52,120.02 96.52,24.77 102.87,18.41 102.87,15.88 107.95,10.79 107.95,6.99 111.12,3.81 120.65,3.81 120.65,51.44 119.38,52.7 IC7.12
N$25  (via drill 0.81)
  Top 0.406: v151.13,95.89 151.13,70.48 149.86,69.22 IC6.9 | v134.62,95.89 R25.1
  Bottom 0.406: v151.13,95.89 v134.62,95.89
N$26  (via drill 0.81)
  Top 0.406: v125.09,67.31 125.09,87.63 121.92,90.81 R28.1 | v134.62,67.31 IC6.3
  Bottom 0.406: v125.09,67.31 v134.62,67.31
N$27  (via drill 0.81)
  Top 0.406: v102.87,59.69 102.87,75.56 104.14,76.83 104.14,114.94 106.68,117.47 123.19,117.47 123.19,103.5 124.46,102.23 R27.1 | v139.7,58.42 IC6.5
  Bottom 0.406: v139.7,58.42 135.89,58.42 134.62,59.69 v102.87,59.69
N$28  (via drill 0.81)
  Top 0.406: v146.05,57.15 146.05,62.87 145.41,63.5 IC6.7 | v135.89,57.15 135.89,87 132.08,90.81 R26.1
  Bottom 0.406: v135.89,57.15 v146.05,57.15
N$29
  Top 0.406: IC7.9 119.38,51.44 118.11,52.7 118.11,71.75 119.38,73.03 R29.1
N$30  (via drill 0.81)
  Top 0.406: v86.36,94.61 v86.36,46.99
  Bottom 0.406: v86.36,46.99 99.69,46.99 100.33,46.35 100.33,45.09 100.97,44.45 104.78,44.45 105.41,45.09 105.41,46.35 106.05,46.99 113.67,46.99 114.3,46.35 IC7.7 | v86.36,94.61 87.63,95.89 128.27,95.89 132.08,99.69 151.13,99.69 152.4,100.97 229.24,100.97 230.5,102.23 239.4,102.23 241.94,99.69 250.82,99.69 251.46,99.06 313.06,99.06 317.5,94.61 R30.1
N$31  (via drill 0.81)
  Top 0.406: v357.5,23.5 357.5,97.79 356.87,98.42 342.9,98.42 R31.1 | v109.22,22.86 IC7.5
  Bottom 0.406: v109.22,22.86 205.74,22.86 207.01,21.59 211.46,21.59 212.72,22.86 279.4,22.86 280.04,22.23 290.83,22.23 292.1,23.5 v357.5,23.5
N$32
  Bottom 0.406: R32.1 52.7,93.98 53.98,92.71 58.42,92.71 60.96,95.25 60.96,97.16 36.83,97.16 34.29,94.61 34.29,53.34 74.93,53.34 77.47,50.8 81.92,50.8 84.45,48.26 99.69,48.26 100.97,46.99 102.23,46.99 103.5,45.72 IC7.3
N$33
  Top 0.406: IC8.18 134.62,53.98 133.35,55.24 R33.1
N$34  (via drill 0.81)
  Top 0.406: v148.59,73.66 148.59,55.88 149.22,55.24 149.22,53.34 IC8.12 | v143.51,73.66 R36.1
  Bottom 0.406: v148.59,73.66 v143.51,73.66
N$35  (via drill 0.81)
  Top 0.406: v138.43,59.69 138.43,71.75 137.16,73.03 137.16,81.92 138.43,83.19 140.97,83.19 R35.1 | v144.78,59.69 IC8.14
  Bottom 0.406: v138.43,59.69 v144.78,59.69
N$36
  Top 0.406: IC8.16 139.7,53.98 140.97,55.24 140.97,78.11 138.43,80.64 R34.1
N$37  (via drill 0.81)
  Top 0.406: v335.28,59.69 IC9.18 | v146.05,88.9 R37.1
  Bottom 0.406: v335.28,59.69 351.15,59.69 354.96,63.5 354.96,88.9 342.26,88.9 339.73,91.44 331.47,91.44 330.83,92.08 319.4,92.08 318.13,90.81 307.34,90.81 306.07,89.53 259.71,89.53 250.82,98.42 241.94,98.42 239.4,100.97 230.5,100.97 229.24,99.69 152.4,99.69 151.13,98.42 132.08,98.42 126.36,92.71 122.56,92.71 121.92,92.08 121.92,90.81 121.28,90.17 114.94,90.17 114.3,89.53 114.3,87.63 124.46,87.63 125.73,88.9 134.62,88.9 135.89,90.17 136.53,90.17 137.16,90.81 137.16,92.08 137.79,92.71 141.6,92.71 142.24,92.08 142.24,90.81 144.15,88.9 v146.05,88.9
N$38
  Top 0.406: IC9.16 340.36,53.98 339.09,55.24 339.09,95.89 333.38,101.6 323.85,101.6 323.85,113.67 323.21,114.3 318.77,114.3 318.77,95.89 320.04,94.61 R38.1
N$39
  Top 0.406: IC9.14 345.44,53.98 346.71,55.24 346.71,92.08 347.98,93.34 R39.1
N$40  (via drill 0.81)
  Top 0.406: v55.88,109.86 55.88,94.61 55.24,93.98 R40.1 | v358.77,110.49 358.77,22.86 358.14,22.23 356.24,22.23 356.24,39.37 351.15,44.45 349.88,44.45 349.25,45.09 349.25,49.53 350.52,50.8 IC9.12
  Bottom 0.406: v55.88,109.86 148.59,109.86 149.86,108.58 189.87,108.58 193.04,111.76 193.04,117.47 237.49,117.47 242.57,112.39 254.63,112.39 255.27,111.76 316.87,111.76 318.13,110.49 329.56,110.49 330.83,111.76 346.07,111.76 347.35,110.49 v358.77,110.49
N$41
  Top 0.406: IC8.9 149.86,46.35 151.13,47.62 151.13,50.16 153.67,52.7 153.67,95.25 151.76,97.16 147.32,97.16 R41.1
N$42  (via drill 0.81)
  Top 0.406: v128.27,46.99 128.27,47.62 132.08,47.62 133.99,45.72 IC8.3 | v139.7,90.17 R44.1
  Bottom 0.406: v128.27,46.99 122.56,46.99 121.28,48.26 100.97,48.26 98.42,50.8 83.19,50.8 81.92,52.07 77.47,52.07 76.83,52.7 76.83,54.61 79.38,54.61 99.69,74.93 108.58,74.93 109.86,76.2 111.12,76.2 112.39,77.47 119.38,77.47 120.65,78.74 132.72,78.74 139.7,85.72 v139.7,90.17
N$43
  Top 0.406: IC8.5 139.7,45.09 140.97,43.81 140.97,42.55 144.15,39.37 154.94,39.37 154.94,109.86 147.96,116.84 130.81,116.84 130.81,97.16 133.35,94.61 133.35,93.34 134.62,92.08 134.62,90.81 136.53,88.9 142.24,88.9 R43.1
N$44
  Top 0.406: IC8.7 144.78,46.35 143.51,47.62 143.51,71.75 144.78,73.03 R42.1
N$45  (via drill 0.81)
  Top 0.406: v356.24,97.16 356.24,46.35 354.33,44.45 352.43,44.45 351.15,45.72 IC9.9 | v137.16,102.23 R45.1
  Bottom 0.406: v356.24,97.16 317.5,97.16 313.06,101.6 251.46,101.6 250.82,102.23 241.94,102.23 236.85,107.31 193.68,107.31 189.87,103.5 152.4,103.5 151.13,102.23 v137.16,102.23
N$46  (via drill 0.81)
  Top 0.406: v344.17,55.24 344.17,46.35 344.81,45.72 IC9.7 | v321.31,55.88 321.31,71.75 321.94,72.39 321.94,88.9 322.58,89.53 R46.1
  Bottom 0.406: v344.17,55.24 343.54,55.88 v321.31,55.88
N$47  (via drill 0.81)
  Top 0.406: v59.69,111.12 v59.69,95.89
  Bottom 0.406: v59.69,95.89 36.83,95.89 35.56,94.61 R47.1 | v59.69,111.12 148.59,111.12 149.86,109.86 189.87,109.86 191.77,111.76 191.77,118.11 192.41,118.11 193.04,118.75 237.49,118.75 242.57,113.67 254.63,113.67 255.27,113.03 305.44,113.03 309.88,117.47 351.79,117.47 357.5,111.76 359.41,111.76 360.05,111.12 360.05,47.62 354.33,47.62 353.69,46.99 340.36,46.99 IC9.5
N$48
  Bottom 0.406: IC9.3 335.92,45.72 337.19,46.99 338.45,46.99 339.09,46.35 339.09,44.45 343.54,44.45 358.77,29.21 358.77,22.23 292.1,22.23 290.83,20.95 280.04,20.95 279.4,21.59 212.72,21.59 211.46,20.32 207.01,20.32 205.74,21.59 76.83,21.59 75.56,22.86 36.2,22.86 20.32,38.73 20.32,94.61 26.67,94.61 30.48,98.42 60.96,98.42 65.41,93.98 R48.1
N$49  (via drill 0.81)
  Top 0.406: v200.66,73.66 IC10.18 | v194.31,73.66 R49.1
  Bottom 0.406: v194.31,73.66 v200.66,73.66
N$50  (via drill 0.81)
  Top 0.406: v202.56,73.66 201.93,74.3 R52.1 | v215.9,73.66 IC10.12
  Bottom 0.406: v202.56,73.66 v215.9,73.66
N$51  (via drill 0.81)
  Top 0.406: v199.39,76.2 R51.1 | v210.82,76.2 IC10.14
  Bottom 0.406: v199.39,76.2 v210.82,76.2
N$52  (via drill 0.81)
  Top 0.406: v205.74,74.93 IC10.16 | v196.85,74.93 R50.1
  Bottom 0.406: v196.85,74.93 v205.74,74.93
N$53  (via drill 0.81)
  Top 0.406: R53.1 v204.47,83.19 | v304.8,83.19 IC11.18
  Bottom 0.406: v204.47,83.19 v304.8,83.19
N$54  (via drill 0.81)
  Top 0.406: v311.15,89.53 311.15,73.03 310.51,72.39 310.51,71.12 IC11.16 | v330.2,89.53 R54.1
  Bottom 0.406: v311.15,89.53 v330.2,89.53
N$55  (via drill 0.81)
  Top 0.406: v29.21,108.58 29.21,103.5 27.94,102.23 R55.1 | v316.23,110.49 316.23,74.3 314.96,73.03 IC11.14
  Bottom 0.406: v29.21,108.58 148.59,108.58 149.86,107.31 189.87,107.31 193.68,111.12 254.63,111.12 255.27,110.49 v316.23,110.49
N$56  (via drill 0.81)
  Top 0.406: v321.31,109.22 321.31,89.53 320.68,88.9 320.68,86.36 320.04,85.72 IC11.12 | v58.42,107.31 58.42,99.06 57.15,97.79 R56.1
  Bottom 0.406: v321.31,109.22 255.27,109.22 254.63,109.86 193.68,109.86 189.87,106.05 149.86,106.05 148.59,107.31 v58.42,107.31
N$57  (via drill 0.81)
  Top 0.406: v214.63,87.63 214.63,70.48 215.9,69.22 IC10.9 | v205.74,87.63 R57.1
  Bottom 0.406: v214.63,87.63 v205.74,87.63
N$58
  Top 0.406: IC10.3 200.66,69.22 199.39,70.48 199.39,74.3 198.12,75.56 R60.1
N$59
  Top 0.406: IC10.5 205.74,64.14 204.47,65.41 204.47,79.38 203.2,80.64 203.2,88.27 200.66,90.81 R59.1
N$60
  Top 0.406: IC10.7 210.82,64.14 209.55,65.41 209.55,75.56 208.28,76.83 208.28,83.19 204.47,87 204.47,89.53 203.2,90.81 R58.1
N$61  (via drill 0.81)
  Top 0.406: v196.85,85.72 196.85,89.53 195.58,90.81 R61.1 | v318.77,85.72 318.77,67.31 320.04,66.04 IC11.9
  Bottom 0.406: v196.85,85.72 v318.77,85.72
N$62  (via drill 0.81)
  Top 0.406: v312.42,88.27 312.42,74.3 313.69,73.03 313.69,64.14 314.32,63.5 IC11.7 | v325.12,88.27 R62.1
  Bottom 0.406: v312.42,88.27 v325.12,88.27
N$63  (via drill 0.81)
  Top 0.406: v255.27,64.77 255.27,71.75 254,73.03 v254,108.58
  Bottom 0.406: v255.27,64.77 287.02,64.77 288.29,66.04 300.36,66.04 301.62,64.77 309.25,64.77 309.88,64.14 IC11.5 | v254,108.58 193.68,108.58 189.87,104.78 149.86,104.78 148.59,106.05 137.16,106.05 135.89,104.78 135.89,103.5 134.62,102.23 132.08,102.23 128.27,98.42 106.05,98.42 104.78,97.16 87.63,97.16 86.36,95.89 85.72,95.89 80.64,90.81 51.44,90.81 49.53,92.71 R63.1
N$65  (via drill 0.81)
  Top 0.406: v207.65,74.93 207.01,75.56 R65.1 | v233.68,74.93 IC12.18
  Bottom 0.406: v207.65,74.93 v233.68,74.93
N$66  (via drill 0.81)
  Top 0.406: v219.71,73.66 R68.1 | v248.92,73.66 IC12.12
  Bottom 0.406: v219.71,73.66 v248.92,73.66
N$67  (via drill 0.81)
  Top 0.406: v213.36,77.47 213.36,80.64 212.72,81.28 R67.1 | v243.84,78.74 IC12.14
  Bottom 0.406: v213.36,77.47 230.5,77.47 231.78,78.74 v243.84,78.74
N$68  (via drill 0.81)
  Top 0.406: v209.55,77.47 R66.1 | v238.76,76.2 IC12.16
  Bottom 0.406: v209.55,77.47 211.46,77.47 212.72,76.2 v238.76,76.2
N$69  (via drill 0.81)
  Top 0.406: IC13.18 v200.66,55.88 | v222.25,55.88 R69.1
  Bottom 0.406: v200.66,55.88 v222.25,55.88
N$70  (via drill 0.81)
  Top 0.406: v207.01,6.99 207.01,52.7 206.38,53.34 IC13.16 | v334.01,7.62 334.01,90.17 332.74,91.44 R70.1
  Bottom 0.406: v207.01,6.99 333.38,6.99 v334.01,7.62
N$71  (via drill 0.81)
  Top 0.406: v210.82,26.67 210.82,43.81 212.09,45.09 212.09,47.62 210.82,48.9 IC13.14 | v45.72,30.48 45.72,36.2 44.45,37.47 44.45,50.16 43.18,51.44 43.18,85.09 38.1,90.17 R71.1
  Bottom 0.406: v210.82,26.67 207.01,26.67 205.74,27.94 95.89,27.94 94.61,29.21 64.14,29.21 62.87,30.48 v45.72,30.48
N$73  (via drill 0.81)
  Top 0.406: v250.19,95.89 250.19,70.48 248.92,69.22 IC12.9 | v223.52,95.89 R73.1
  Bottom 0.406: v250.19,95.89 v223.52,95.89
N$74  (via drill 0.81)
  Top 0.406: v217.17,68.58 217.17,74.3 215.9,75.56 215.9,88.27 215.26,88.9 211.46,88.9 211.46,90.17 210.82,90.81 R76.1 | v233.68,67.31 IC12.3
  Bottom 0.406: v233.68,67.31 220.98,67.31 219.71,68.58 v217.17,68.58
N$75  (via drill 0.81)
  Top 0.406: v240.03,97.16 240.03,64.14 239.4,63.5 IC12.5 | v213.36,97.16 R75.1
  Bottom 0.406: v240.03,97.16 v213.36,97.16
N$76  (via drill 0.81)
  Top 0.406: v242.57,80.01 242.57,70.48 243.84,69.22 IC12.7 | v220.98,78.74 R74.1
  Bottom 0.406: v242.57,80.01 231.78,80.01 230.5,78.74 v220.98,78.74
N$77
  Top 0.406: IC13.9 215.9,46.35 214.63,47.62 214.63,65.41 212.09,67.94 212.09,79.38 210.82,80.64 210.82,88.27 208.28,90.81 R77.1
N$78  (via drill 0.81)
  Top 0.406: v209.55,27.94 209.55,45.09 210.19,45.72 IC13.7 | v331.47,36.83 331.47,71.75 332.74,73.03 332.74,90.17 331.47,91.44 331.47,94.61 332.74,95.89 337.82,95.89 R78.1
  Bottom 0.406: v209.55,27.94 231.14,27.94 234.95,31.75 234.95,33.02 237.49,35.56 283.21,35.56 284.48,36.83 302.26,36.83 303.53,35.56 313.06,35.56 314.32,36.83 v331.47,36.83
N$79  (via drill 0.81)
  Top 0.406: v64.77,30.48 64.77,52.07 63.5,53.34 R79.1 | v205.74,29.21 IC13.5
  Bottom 0.406: v64.77,30.48 94.61,30.48 95.89,29.21 v205.74,29.21
N$81  (via drill 0.81)
  Top 0.406: v233.68,58.42 IC14.18 | v224.79,58.42 R81.1
  Bottom 0.406: v224.79,58.42 v233.68,58.42
N$82  (via drill 0.81)
  Top 0.406: v247.65,77.47 247.65,62.87 248.28,62.23 248.28,60.96 248.92,60.33 IC14.12 | v232.41,77.47 R84.1
  Bottom 0.406: v247.65,77.47 v232.41,77.47
N$83  (via drill 0.81)
  Top 0.406: v242.57,68.58 242.57,53.98 243.21,53.34 IC14.14 | v229.87,68.58 R83.1
  Bottom 0.406: v242.57,68.58 v229.87,68.58
N$84
  Top 0.406: IC14.16 238.76,52.7 240.03,51.44 240.03,40.01 229.24,29.21 226.06,29.21 226.06,79.38 227.33,80.64 R82.1
N$85
  Bottom 0.406: R85.1 324.49,81.28 334.64,71.12 IC15.18
N$86  (via drill 0.81)
  Top 0.406: IC15.16 v340.36,88.9 | v335.28,88.9 R86.1
  Bottom 0.406: v340.36,88.9 v335.28,88.9
N$89
  Top 0.406: IC14.9 248.92,45.09 250.19,43.81 250.19,42.55 250.82,41.91 254.63,41.91 254.63,60.96 252.73,62.87 252.73,71.75 251.46,73.03 251.46,96.52 249.56,98.42 236.22,98.42 R89.1
N$90
  Top 0.406: IC14.3 233.68,45.09 231.14,42.55 231.14,32.38 229.24,30.48 227.33,30.48 227.33,79.38 228.6,80.64 R196.1
N$91
  Top 0.406: IC14.5 238.76,51.44 237.49,52.7 237.49,83.19 231.14,89.53 R188.1
N$92  (via drill 0.81)
  Top 0.406: v245.11,88.9 245.11,52.7 243.84,51.44 IC14.7 | v233.68,88.9 R187.1
  Bottom 0.406: v245.11,88.9 v233.68,88.9
N$93  (via drill 0.81)
  Top 0.406: v349.25,87.63 349.25,64.14 349.88,63.5 IC15.9 | v226.06,87 R197.1
  Bottom 0.406: v226.06,87 334.64,87 335.28,87.63 v349.25,87.63
N$94  (via drill 0.81)
  Top 0.406: v341.63,64.77 341.63,89.53 340.36,90.81 R198.1
  Bottom 0.406: v341.63,64.77 344.81,64.77 345.44,64.14 IC15.7
N$179
  Top 0.406: R91.2 71.12,38.73 72.39,40.01 72.39,47.62 73.66,48.9 X1.3
N$180
  Top 0.406: R90.2 68.58,38.73 69.85,40.01 69.85,47.62 71.12,48.9 X1.5
N$181
  Top 0.406: R92.2 66.04,45.09 67.31,46.35 67.31,47.62 68.58,48.9 X1.7
N$182
  Top 0.406: R93.2 60.96,28.57 62.23,29.84 62.23,47.62 63.5,48.9 X1.11
N$183
  Top 0.406: R94.1 45.72,46.35 X1.26
N$184
  Top 0.406: R95.1 55.88,38.73 54.61,40.01 54.61,47.62 53.34,48.9 X1.19
N$185
  Top 0.406: R96.1 53.34,38.73 52.07,40.01 52.07,47.62 50.8,48.9 X1.21
N$186
  Top 0.406: R97.1 50.8,38.73 49.53,40.01 49.53,47.62 48.26,48.9 X1.23
N$187
  Top 0.406: R98.1 48.26,46.35 X1.24
N$188
  Top 0.406: R99.2 63.5,46.35 X1.12
N$189
  Top 0.406: R104.2 38.1,46.35 X1.32
N$190
  Top 0.406: R102.2 35.56,38.73 34.29,40.01 34.29,47.62 35.56,48.9 X1.33
N$191
  Top 0.406: R100.2 43.18,38.73 41.91,40.01 41.91,47.62 40.64,48.9 X1.29
N$192
  Top 0.406: R101.2 40.64,38.73 39.37,40.01 39.37,47.62 38.1,48.9 X1.31
N$194
  Top 0.406: R103.2 33.02,46.35 X1.36
OPR
  Top 0.406: R62.2 325.12,104.78 327.66,107.31 D40.16
PAUSE
  Top 0.406: R31.2 342.9,104.78 346.71,108.58 346.71,113.67 347.98,114.94 D40.31
PC0
  Top 0.406: R1.2 105.41,113.67 106.68,114.94 E40.1
PC1
  Top 0.406: R9.2 E40.10
PC2
  Top 0.406: R17.2 118.11,113.67 119.38,114.94 E40.11
PC3
  Top 0.406: R25.2 E40.24
PC4  (via drill 0.81)
  Top 0.406: v135.89,91.44 135.89,113.67 136.53,114.3 136.53,115.57 E40.25
  Bottom 0.406: R33.2 v135.89,91.44
PC5
  Top 0.406: E40.34 R41.2
PC6
  Top 0.406: R49.2 194.31,113.67 195.58,114.94 F40.1
PC7
  Top 0.406: R57.2 F40.10
PC8
  Top 0.406: R65.2 207.01,113.67 208.28,114.94 F40.11
PC9
  Top 0.406: R73.2 F40.24
PC10
  Top 0.406: R81.2 224.79,113.67 226.06,114.94 F40.25
PC11
  Top 0.406: R89.2 F40.34
RUN
  Top 0.406: R39.2 347.98,104.78 349.25,106.05 349.25,113.67 350.52,114.94 D40.33
SC0
  Top 0.406: R47.2 35.56,113.67 34.29,114.94 C40.9
SC1  (via drill 0.81)
  Top 0.406: v24.13,104.14 C40.2
  Bottom 0.406: v24.13,104.14 R55.2
SC2
  Top 0.406: R63.2 49.53,104.78 50.8,106.05 50.8,113.67 52.07,114.94 C40.23
SC3
  Top 0.406: R71.2 38.1,104.78 36.83,106.05 C40.12
SC4
  Top 0.406: R79.2 63.5,113.67 64.77,114.94 C40.33
TAD
  Top 0.406: R14.2 D40.4
VCC  (via drill 0.81)
  Top 0.406: v73.66,19.68 73.66,46.35 X1.4 74.3,46.99 75.56,46.99 X1.2 76.83,46.99 78.11,48.26 v78.11,53.34 | v290.19,71.12 v290.19,53.34
  Bottom 0.406: IC4.20 99.06,71.75 99.69,72.39 122.56,72.39 123.83,71.12 IC6.20 129.54,71.75 130.18,72.39 153.03,72.39 154.31,71.12 IC10.20 195.58,71.75 196.22,72.39 219.07,72.39 220.34,71.12 IC12.20 228.6,71.75 229.24,72.39 252.09,72.39 253.37,71.12 276.86,71.12 280.04,74.3 284.48,74.3 287.65,71.12 v290.19,71.12 IC11.20 299.72,71.75 300.36,72.39 323.21,72.39 324.49,71.12 IC15.20 | IC3.20 27.94,18.41 28.57,19.05 51.44,19.05 52.7,17.78 IC2.20 63.5,18.41 64.14,19.05 73.66,19.05 | 73.66,19.05 87,19.05 88.27,17.78 IC1.20 | v73.66,19.68 73.66,19.05 | IC9.20 324.49,53.34 323.21,54.61 300.36,54.61 299.72,53.98 IC5.20 v290.19,53.34 253.37,53.34 252.09,54.61 229.24,54.61 228.6,53.98 IC14.20 220.34,53.34 219.07,54.61 196.22,54.61 195.58,53.98 IC13.20 154.31,53.34 153.03,54.61 130.18,54.61 129.54,53.98 IC8.20 123.83,53.34 122.56,54.61 99.69,54.61 99.06,53.98 IC7.20 v78.11,53.34
WC
  Top 0.406: R198.2 340.36,104.78 341,105.41 341,107.95 341.63,108.58 341.63,113.67 342.26,114.3 345.44,114.3 D40.30
XCOL1  (via drill 0.81)
  Top 0.406: v67.31,20.32 67.31,13.97 66.04,12.7 IC2.2 | v71.12,20.32 R91.1
  Bottom 0.406: v67.31,20.32 v71.12,20.32
XCOL2
  Top 0.406: IC2.4 71.12,10.79 69.85,12.06 69.85,26.04 68.58,27.3 R90.1
XCOL3  (via drill 0.81)
  Top 0.406: v74.93,21.59 74.93,17.14 75.56,16.51 75.56,13.97 76.2,13.34 IC2.6 | v66.04,21.59 R92.1
  Bottom 0.406: v74.93,21.59 v66.04,21.59
XCOL4  (via drill 0.81)
  Top 0.406: v80.01,26.67 80.01,17.14 81.28,15.88 IC2.8
  Bottom 0.406: v80.01,26.67 43.81,26.67 43.18,27.3 R100.1
XCOL5
  Top 0.406: R101.1 40.64,27.3 41.91,26.04 41.91,17.14 42.55,16.51 46.99,16.51 46.99,79.38 67.31,99.69 83.19,99.69 87.63,95.25 87.63,46.35 86.36,45.09 IC2.11
XCOL6  (via drill 0.81)
  Top 0.406: v45.72,25.4 R94.2 | v81.28,25.4 IC2.13
  Bottom 0.406: v45.72,25.4 v81.28,25.4
XCOL7  (via drill 0.81)
  Top 0.406: v48.26,24.13 R98.2 | v76.2,24.13 IC2.15
  Bottom 0.406: v48.26,24.13 v76.2,24.13
XCOL8
  Top 0.406: R96.2 53.34,27.3 54.61,26.04 54.61,5.71 56.52,3.81 72.39,3.81 72.39,15.88 71.12,17.14 IC2.17
XCOL9  (via drill 0.81)
  Top 0.406: IC3.2 v30.48,13.97 | v55.88,13.97 R95.2
  Bottom 0.406: v30.48,13.97 v55.88,13.97
XCOL10  (via drill 0.81)
  Top 0.406: v36.83,21.59 36.83,17.14 35.56,15.88 IC3.4 | v50.8,21.59 R97.2
  Bottom 0.406: v36.83,21.59 v50.8,21.59
XCOL11
  Top 0.406: IC3.6 40.64,15.88 39.37,17.14 39.37,26.04 38.1,27.3 R104.1
XCOL12
  Top 0.406: IC3.8 45.72,6.99 40.01,1.27 20.32,1.27 20.32,48.9 24.77,53.34 36.83,53.34 36.83,29.84 35.56,28.57 R102.1
XLED1  (via drill 0.81)
  Top 0.406: v31.75,12.7 31.75,24.77 30.48,26.04 30.48,46.35 X1.38 | v101.6,12.7 IC1.2
  Bottom 0.406: v31.75,12.7 v101.6,12.7
XLED2  (via drill 0.81)
  Top 0.406: v29.21,6.35 29.21,43.18 27.94,44.45 27.94,46.35 X1.40 | v106.68,7.62 IC1.4
  Bottom 0.406: v106.68,7.62 57.78,7.62 56.52,6.35 v29.21,6.35
XLED3  (via drill 0.81)
  Top 0.406: v57.15,5.08 57.15,47.62 57.78,48.26 57.78,49.53 X1.15 | v111.76,5.08 IC1.6
  Bottom 0.406: v57.15,5.08 v111.76,5.08
XLED4  (via drill 0.81)
  Top 0.406: v58.42,6.35 58.42,46.35 X1.16 | v116.84,6.35 IC1.8
  Bottom 0.406: v58.42,6.35 v116.84,6.35
XLED5  (via drill 0.81)
  Top 0.406: v121.92,34.29 IC1.11
  Bottom 0.406: v121.92,34.29 67.94,34.29 64.77,37.47 64.77,40.01 59.05,40.01 57.78,41.27 50.16,41.27 48.9,42.55 25.4,42.55 24.77,43.18 24.77,46.35 26.67,48.26 26.67,50.16 27.3,50.8 53.98,50.8 54.61,50.16 54.61,48.9 55.88,47.62 X1.18
XLED6  (via drill 0.81)
  Top 0.406: v50.8,42.55 50.8,46.35 X1.22 | v116.84,39.37 IC1.13
  Bottom 0.406: v116.84,39.37 103.5,39.37 102.23,38.1 78.74,38.1 76.83,40.01 66.67,40.01 65.41,41.27 59.05,41.27 57.78,42.55 v50.8,42.55
XLED7  (via drill 0.81)
  Top 0.406: v34.29,15.24 34.29,18.41 33.02,19.68 33.02,24.77 31.75,26.04 31.75,48.9 31.11,49.53 X1.37 | v111.76,15.24 IC1.15
  Bottom 0.406: v111.76,15.24 88.27,15.24 87,16.51 41.27,16.51 40.01,15.24 v34.29,15.24
XLED8  (via drill 0.81)
  Top 0.406: v105.41,43.18 105.41,18.41 106.05,17.78 IC1.17 | v59.69,42.55 59.69,47.62 60.33,48.26 60.33,49.53 X1.13
  Bottom 0.406: v105.41,43.18 78.74,43.18 76.83,41.27 66.67,41.27 65.41,42.55 v59.69,42.55

## Text on the board
Bottom: PuDP-8/I Interface Board